# EAGLE design cardlogger (EAGLE 7.2.0)
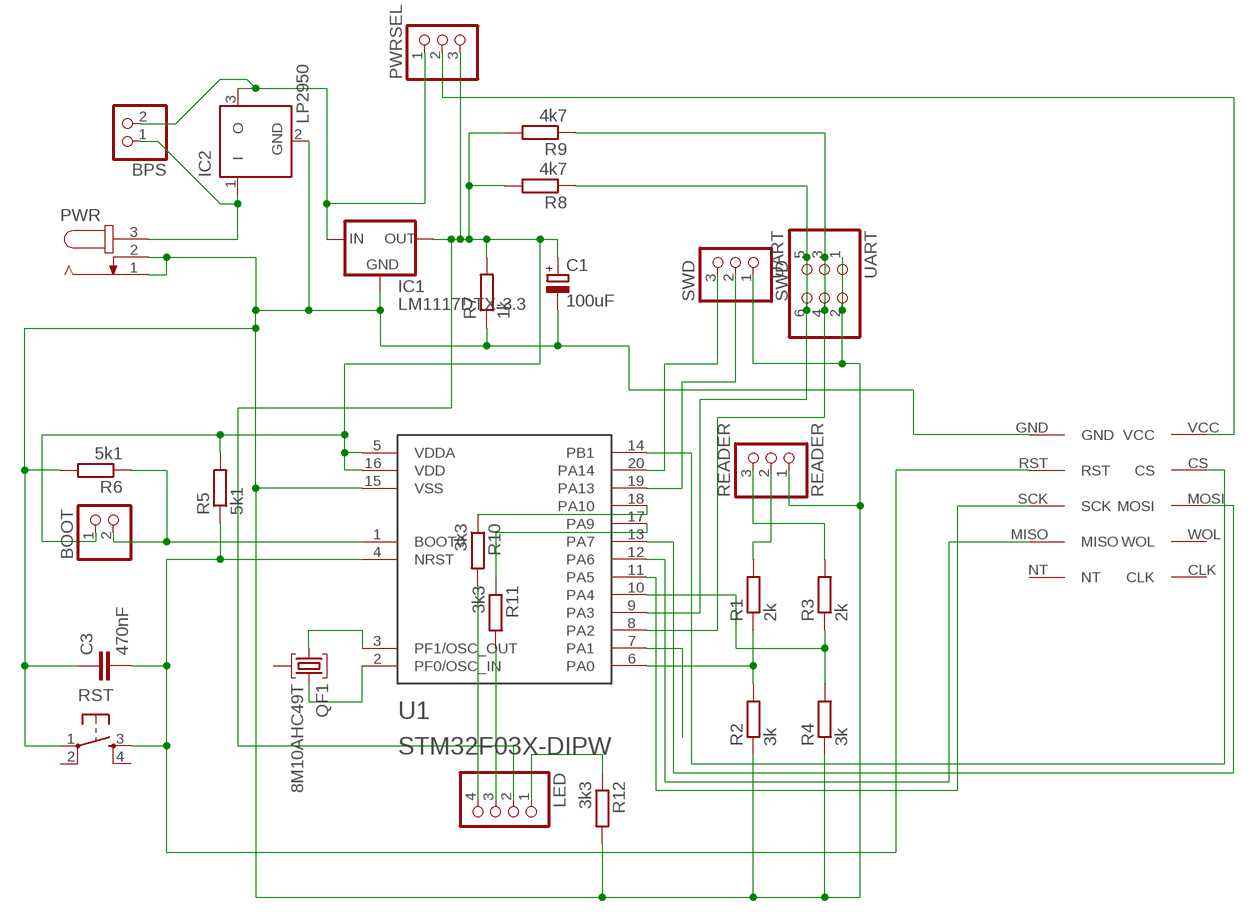
[diagram p0: schematic, sheet 1]

## Parts
BOOT  PINHD-1X2  [1X02]
BPS  PINHD-1X2  [1X02]
C1  100uF  CPOL-EUSMCD  [SMC_D]
C3  470nF  C-EUC0805  [C0805]
IC1  LM1117DTX-3.3  [TO252]
IC2  LP2950  [DPACK]
LED  PINHD-1X4  [1X04]
PWR  JACK-PLUG0  [SPC4077]
PWRSEL  PINHD-1X3  [1X03]
QF1  8M10AHC49T  [HC49U]
R1  2k  R-EU_R1206  [R1206]
R2  3k  R-EU_R1206  [R1206]
R3  2k  R-EU_R1206  [R1206]
R4  3k  R-EU_R1206  [R1206]
R5  5k1  R-EU_R1206  [R1206]
R6  5k1  R-EU_R1206  [R1206]
R7  1k  R-EU_R1206  [R1206]
R8  4k7  R-EU_R1206  [R1206]
R9  4k7  R-EU_R1206  [R1206]
R10  3k3  R-EU_R1206  [R1206]
R11  3k3  R-EU_R1206  [R1206]
R12  3k3  R-EU_R1206  [R1206]
READER  READER  PINHD-1X3  [1X03]
RST  TAC_SWITCHPTH  [TACTILE-PTH]
SWD  SWD  PINHD-1X3  [1X03]
U1  STM32F03X-DIPW  [DIP20W]
U$1  ENC28J60  [ENC28J60]
UART  UART  PINHD-2X3  [2X03]

## Nets
+3V3: BOOT.1 C1.+ IC1.TAB(OUT) LED.2 PWRSEL.3 R5.2 R7.2 R8.2 R9.2 U1.5(VDDA) U1.16(VDD)
BOOT: BOOT.2 R6.1 U1.1(BOOT0)
CR_0: R1.2 READER.2
CR_1: R3.2 READER.3
EXTI_1: R3.1 R4.2 U1.10(PA4)
EXYI_0: R1.1 R2.2 U1.6(PA0)
GND: C1.- C3.1 IC1.1(GND) IC2.2(GND) PWR.1 PWR.2 R2.1 R4.1 R6.2 R7.1 R12.2 READER.1 RST.1 SWD.1 U1.15(VSS) U$1.GND UART.1 UART.2
N$1: SWD.2 U1.19(PA13)
N$2: SWD.3 U1.20(PA14)
N$3: LED.4 R10.2
N$4: U1.11(PA5) U$1.SCK
N$5: U1.12(PA6) U$1.MISO
N$6: U1.13(PA7) U$1.MOSI
N$7: U1.14(PB1) U$1.CS
N$8: U1.7(PA1)
N$9: R11.1 U1.17(PA9)
N$10: PWRSEL.2 U$1.VCC
N$11: BPS.1 IC2.1(I) PWR.3
N$12: BPS.2 IC1.2(IN) IC2.3(O) PWRSEL.1
N$13: R10.1 U1.18(PA10)
N$14: QF1.1 U1.3(PF1/OSC_OUT)
N$15: QF1.3 U1.2(PF0/OSC_IN)
N$17: LED.3 R11.2
N$18: LED.1 R12.1
RST: C3.2 R5.1 RST.3 U1.4(NRST) U$1.RST
RX: R8.1 U1.9(PA3) UART.5 UART.6
TX: R9.1 U1.8(PA2) UART.3 UART.4
Unconnected: QF1.2 RST.2 RST.4 U$1.CLK U$1.NT U$1.WOL

## Library data of the parts
BOOT BPS = pinhead:PINHD-1X2: PIN HEADER
C1 = resistor:CPOL-EU: POLARIZED CAPACITOR, European symbol
C3 = rcl:C-EU: CAPACITOR, European symbol
IC1 = lm1117:LM1117DTX-*
IC2 = linear:LP2950: 100 mA, Low Power Low Dropout Voltage Regulator Source: http://www.onsemi.com/pub/Collateral/LP2950-D.PDF
LED = pinhead:PINHD-1X4: PIN HEADER
PWR = con-jack:JACK-PLUG: DC POWER JACK Power Jack, DC, Right Angle, Through Hole, Rated 5A at 16VDC, PC Terminals Distributor: Farnell (www.Farnell.de) Drawing: 84N1161.pdf / 84N1162.pdf Manufacturer: SPC Technology (www.spctechnology.com) Type: SPC4077 / SPC 4078; OC_FARNELL: unknown; OC_NEWARK: unknown
PWRSEL READER SWD = pinhead:PINHD-1X3: PIN HEADER
QF1 = crystal:8M10AHC49T: Monolithic Crystal Filters Source: www.vanlong.com; OC_FARNELL: unknown; OC_NEWARK: unknown
R1-R12 = rcl:R-EU_: RESISTOR, European symbol
RST = SparkFun:TAC_SWITCH: Momentary Switch Button commonly used for reset or general input. Spark Fun Electronics SKU : COM-00097
U1 = stm32f030x:STM32F03X-DIPW
U$1 = Boards:ENC28J60: enc28j60 ethernet board for controllers
UART = pinhead:PINHD-2X3: PIN HEADER

## Board
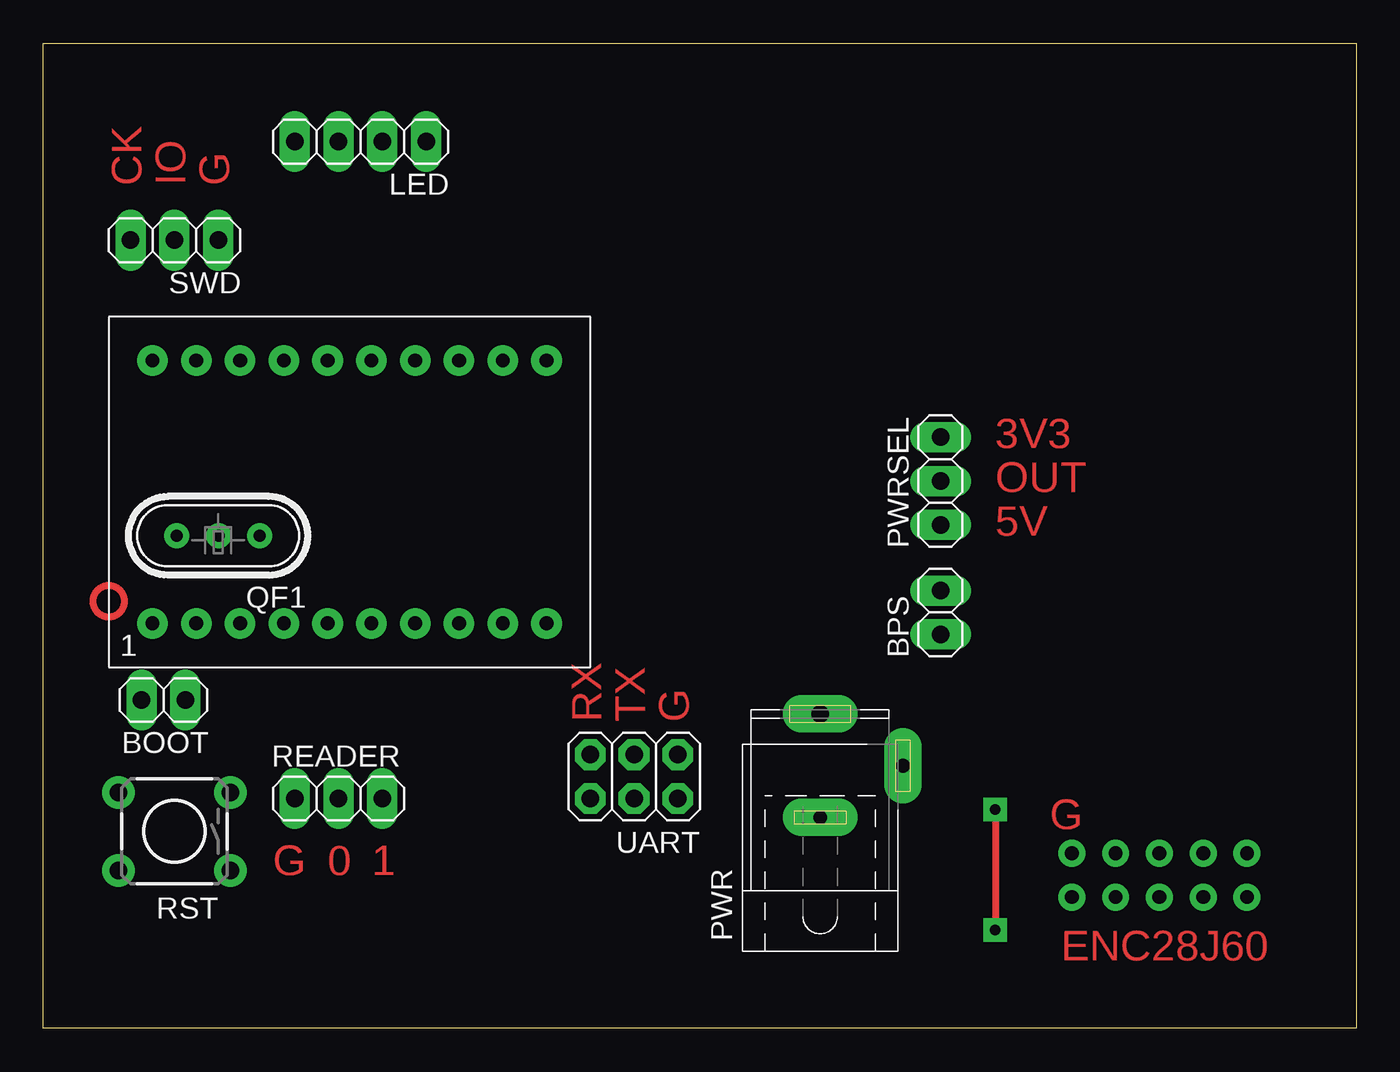
[diagram p1: board, top side]
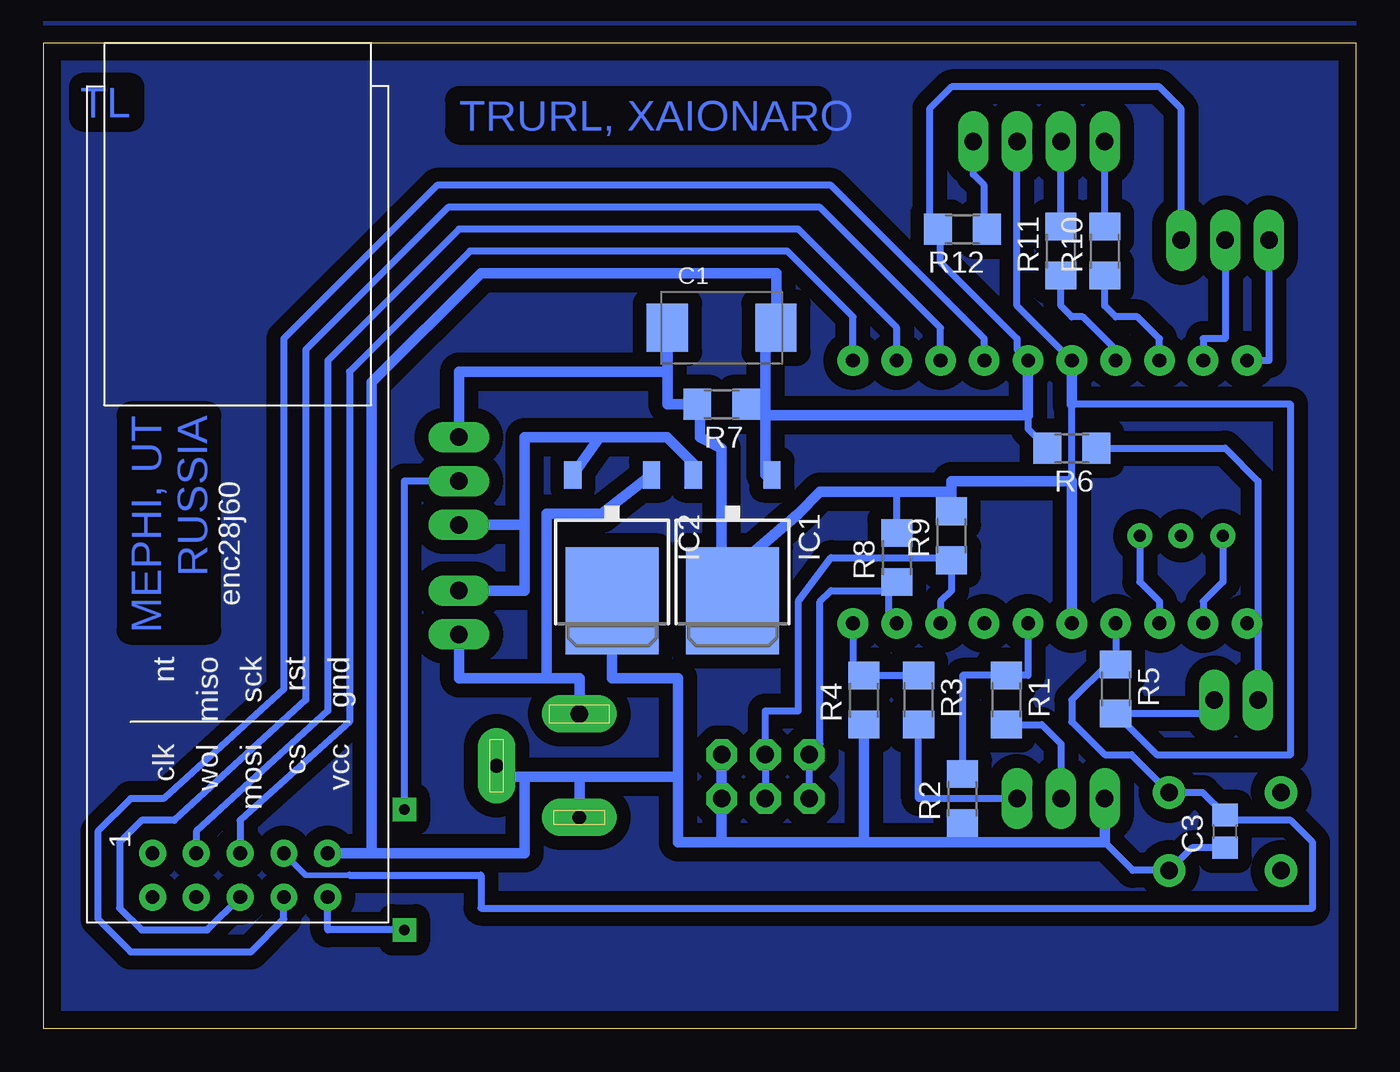
[diagram p2: board, bottom side, seen from below]

Size 76.2 x 57.15 mm. Coordinates in mm from the lower left corner, seen from the top.
Outline: 0,0 0,57.15 76.2,57.15 76.2,0 0,0
Copper layers (1*16): Top 0.035mm / dielectric 1.5mm / Bottom 0.035mm
Design rules "default *": minimum track width 10mil, minimum drill 24mil, track to track 8mil, track to pad 8mil, pad to pad 8mil, via to via 8mil, smd to smd 8mil, copper to edge 40mil, drill to drill 8mil, minimum pad ring 15mil, minimum via ring 15mil, stop-mask expansion 4mil, vias tented up to drill 0mil, thermal gap 10mil

### Footprints (pad centres in the part's own frame; a part is rotated, then mirrored left to right if it is on the bottom)
1X02 = drill 1.016 long: 1 -1.27,0; 2 1.27,0
SMC_D = smd 2.4 x 2.8: + -3.15,0; - 3.15,0
C0805 = smd 1.3 x 1.5: 1 -0.95,0; 2 0.95,0
TO252 = smd 1 x 1.6: 1 -2.28,-4.8; 2 2.28,-4.8 | smd 5.4 x 6.2: TAB 0,2.5
DPACK = smd 1 x 1.6: 1 -2.28,-4.8; 3 2.28,-4.8 | smd 5.4 x 6.2: 2 0,2.5
1X04 = drill 1.016 long: 1 -3.81,0; 2 -1.27,0; 3 1.27,0; 4 3.81,0
SPC4077 = drill 0.8 pad 2.184 long: 1 -3,0; 2 0,-4.8 | drill 1 pad 2.184 long: 3 3,0
1X03 = drill 1.016 long: 1 -2.54,0; 2 0,0; 3 2.54,0
HC49U = drill 0.7 pad 1.2: 1 -2.413,0; 2 -0.027,0; 3 2.413,0
R1206 = smd 1.6 x 1.803: 1 -1.422,0; 2 1.422,0
TACTILE-PTH = drill 1.016 pad 1.88: 1 -3.251,2.261; 2 3.251,2.261; 3 -3.251,-2.261; 4 3.251,-2.261
DIP20W = drill 0.8 pad 1.778: 1 2.54,2.54; 2 5.08,2.54; 3 7.62,2.54; 4 10.16,2.54; 5 12.7,2.54; 6 15.24,2.54; 7 17.78,2.54; 8 20.32,2.54; 9 22.86,2.54; 10 25.4,2.54; 11 25.4,17.78; 12 22.86,17.78; 13 20.32,17.78; 14 17.78,17.78; 15 15.24,17.78; 16 12.7,17.78; 17 10.16,17.78; 18 7.62,17.78; 19 5.08,17.78; 20 2.54,17.78
ENC28J60 = drill 0.8: CLK 49.53,3.81; CS 49.53,11.43; GND 46.99,13.97; MISO 46.99,6.35; MOSI 49.53,8.89; NT 46.99,3.81; RST 46.99,11.43; SCK 46.99,8.89; VCC 49.53,13.97; WOL 49.53,6.35
2X03 = drill 1.016 octagon: 1 -2.54,-1.27; 2 -2.54,1.27; 3 0,-1.27; 4 0,1.27; 5 2.54,-1.27; 6 2.54,1.27

### Placement (x,y rotation side)
BOOT  6.99,19.05 180 top
BPS  52.07,24.13 90 top
C1  36.83,40.64 0 bottom
C3  7.62,11.43 90 bottom
IC1  36.2,27.3 180 bottom
IC2  43.18,27.3 180 bottom
LED  18.41,51.44 180 top
PWR  45.09,15.24 90 top
PWRSEL  52.07,31.75 90 top
QF1  10.16,28.57 180 top
R1  20.32,19.05 270 bottom
R2  22.86,13.34 90 bottom
R3  25.4,19.05 270 bottom
R4  28.57,19.05 90 bottom
R5  13.97,19.68 270 bottom
R6  16.51,33.66 180 bottom
R7  36.83,36.2 180 bottom
R8  26.67,27.3 90 bottom
R9  23.5,28.57 90 bottom
R10  14.61,45.09 90 bottom
R11  17.14,45.09 90 bottom
R12  22.86,46.35 180 bottom
READER  17.14,13.34 0 top
RST  7.62,11.43 180 top
SWD  7.62,45.72 180 top
U1  3.81,20.95 0 top
U$1  73.66,57.15 270 bottom
UART  34.29,14.61 180 top

### Tracks (layer width: path | path; a pad name or v marks a point on that pad's centre or on a via)
+3V3
  Bottom 0.406: 23.65,29.84 R9.2 | 25.88,28.73 R8.2 26.67,31.11 | BOOT.1 9.04,18.26 R5.2 11.58,15.88 3.81,15.88 3.81,36.2 16.51,36.2 | 16.51,31.75 16.51,36.83 | U1.16 19.68,41.91 LED.2
  Bottom 0.61: 39.98,38.1 39.98,36.2 R7.2 38.1,36.2 38.1,34.29 36.83,33.66 36.83,26.04 | 39.98,38.1 C1.+ | U1.16 16.51,36.83 16.51,36.2 | U1.5 16.51,31.75 23.5,31.75 R9.2 23.5,31.11 26.67,31.11 31.11,31.11 32.38,29.84 36.83,26.04 | 36.83,26.04 IC1.TAB | PWRSEL.3 52.07,38.1 39.98,38.1
BOOT
  Bottom 0.406: U1.1 5.71,23.5 | R6.1 7.62,33.66 5.71,31.75 5.71,23.5 | 5.71,23.5 BOOT.2
CR_0
  Bottom 0.406: R1.2 18.26,17.63 17.14,16.51 READER.2
CR_1
  Bottom 0.406: READER.3 25.4,13.34 R3.2
EXTI_1
  Bottom 0.406: U1.10 29.21,21.11 R4.2 R3.1
EXYI_0
  Bottom 0.406: U1.6 19.05,20.47 R1.1 22.86,20.47 R2.2
GND
  Bottom 0.406: 19.05,35.56 19.05,34.77 R6.2 | C3.1 9.56,10.48 RST.1 12.98,9.17 14.61,10.79 | 10.16,46.35 SWD.1 10.16,53.34 11.43,54.61 23.5,54.61 24.77,53.34 24.77,46.84 R12.2 24.13,46.2 24.13,44.45 19.68,40.01 19.68,39.37 U1.15
  Bottom 0.61: IC1.1 34.29,32.1 34.29,35.56 | 34.29,35.56 34.29,36.2 | 34.29,36.2 R7.1 | 34.29,36.2 34.29,41.27 C1.- 33.66,40.64 33.66,43.81 50.8,43.81 57.15,37.47 57.15,10.16 | U1.15 19.05,35.56 34.29,35.56 | 36.83,10.79 28.57,10.79 | 28.57,10.79 22.86,10.79 | 22.86,10.79 14.61,10.79 READER.1 | R4.1 28.57,10.79 | R2.1 22.86,10.79 | UART.2 UART.1 36.83,10.79 | IC2.2 43.18,20.32 39.37,20.32 39.37,14.61 | 39.37,14.61 39.37,10.79 36.83,10.79 | U$1.GND 57.15,10.16 | PWR.1 45.09,14.61 | 45.09,14.61 39.37,14.61 | PWR.2 49.88,14.61 48.26,14.61 | 48.26,14.61 45.09,14.61 | 57.15,10.16 48.26,10.16 48.26,14.61
N$1
  Bottom 0.406: SWD.2 7.62,40.01 8.89,40.01 U1.19
N$2
  Bottom 0.406: SWD.3 5.08,38.73 U1.20
N$3
  Bottom 0.406: R10.2 LED.4
N$4
  Bottom 0.406: U1.11 29.21,41.27 33.02,45.09 51.44,45.09 58.42,38.1 58.42,17.78 64.77,12.06 U$1.SCK
N$5
  Bottom 0.406: U1.12 26.67,40.64 32.38,46.35 52.07,46.35 59.69,38.73 59.69,18.41 67.31,11.43 U$1.MISO
N$6
  Bottom 0.406: U1.13 24.13,40.64 31.11,47.62 52.7,47.62 60.96,39.37 60.96,19.05 68.58,12.06 70.48,12.06 71.75,10.79 71.75,6.99 70.48,5.71 66.67,5.71 U$1.MOSI
N$7
  Bottom 0.406: U1.14 21.59,40.01 30.48,48.9 53.34,48.9 62.23,40.01 62.23,19.68 69.22,13.34 71.12,13.34 73.03,11.43 73.03,6.35 71.12,4.45 64.14,4.45 62.23,6.35 U$1.CS
N$9
  Bottom 0.406: U1.17 13.97,39.37 15.88,41.27 16.51,41.27 17.14,41.91 R11.1
N$10  (via drill 0.6)
  Top 0.406: v55.24,12.7 v55.24,5.71
  Bottom 0.406: v55.24,5.71 59.69,5.71 U$1.VCC | PWRSEL.2 55.24,31.75 v55.24,12.7
N$11
  Bottom 0.61: IC2.1 43.8,29.84 46.99,29.84 46.99,20.32 | 46.99,20.32 45.09,20.32 PWR.3 | BPS.1 52.07,20.32 46.99,20.32
N$12
  Bottom 0.61: IC2.3 43.91,34.29 | 43.91,34.29 40.01,34.29 38.48,32.76 IC1.2 | PWRSEL.1 48.26,29.21 | 48.26,29.21 48.26,34.29 43.91,34.29 | BPS.2 48.26,25.4 48.26,29.21
N$13
  Bottom 0.406: U1.18 11.43,40.01 12.7,41.27 13.97,41.27 14.61,41.91 R10.1
N$14
  Bottom 0.406: QF1.1 12.57,25.91 11.43,24.77 U1.3
N$15
  Bottom 0.406: QF1.3 7.75,25.91 8.89,24.77 U1.2
N$16
  pour Bottom (isolate 0.813): 0,0 76.2,0 76.2,55.88 76.2,58.42 0,58.42
N$17
  Bottom 0.406: R11.2 LED.3
N$18
  Bottom 0.406: R12.1 21.59,46.35 21.59,48.9 22.23,49.53 LED.1
RST
  Bottom 0.305: U$1.RST 60.96,8.89 58.42,8.89
  Bottom 0.406: U1.4 R5.1 14.45,21.11 16.51,19.05 16.51,17.78 14.61,15.88 13.06,15.88 RST.3 8.93,13.69 C3.2 7.3,12.06 3.81,12.06 2.54,10.79 2.54,6.99 50.8,6.99 50.8,8.89 58.42,8.89
RX
  Bottom 0.406: 27.15,25.4 30.48,25.4 31.11,24.77 31.11,16.51 UART.5 UART.6 | 27.15,25.4 R8.1 | 27.15,25.4 27.15,23.98 U1.9
TX
  Bottom 0.406: U1.8 24.13,24.77 23.5,25.4 R9.1 23.65,27.3 30.48,27.3 32.38,24.77 32.38,18.41 34.29,18.41 UART.3 UART.4
(copper drawn outside any net)
  shapes: Top circle x1

### Text on the board
Top: CK | IO | G | 3V3 | OUT | 5V | RX | TX | G | G | G | 0 | 1 | ENC28J60
Bottom: TL | TRURL, XAIONARO | MEPHI, UT / RUSSIA